# EAGLE design 00A-95 (EAGLE 6.3)
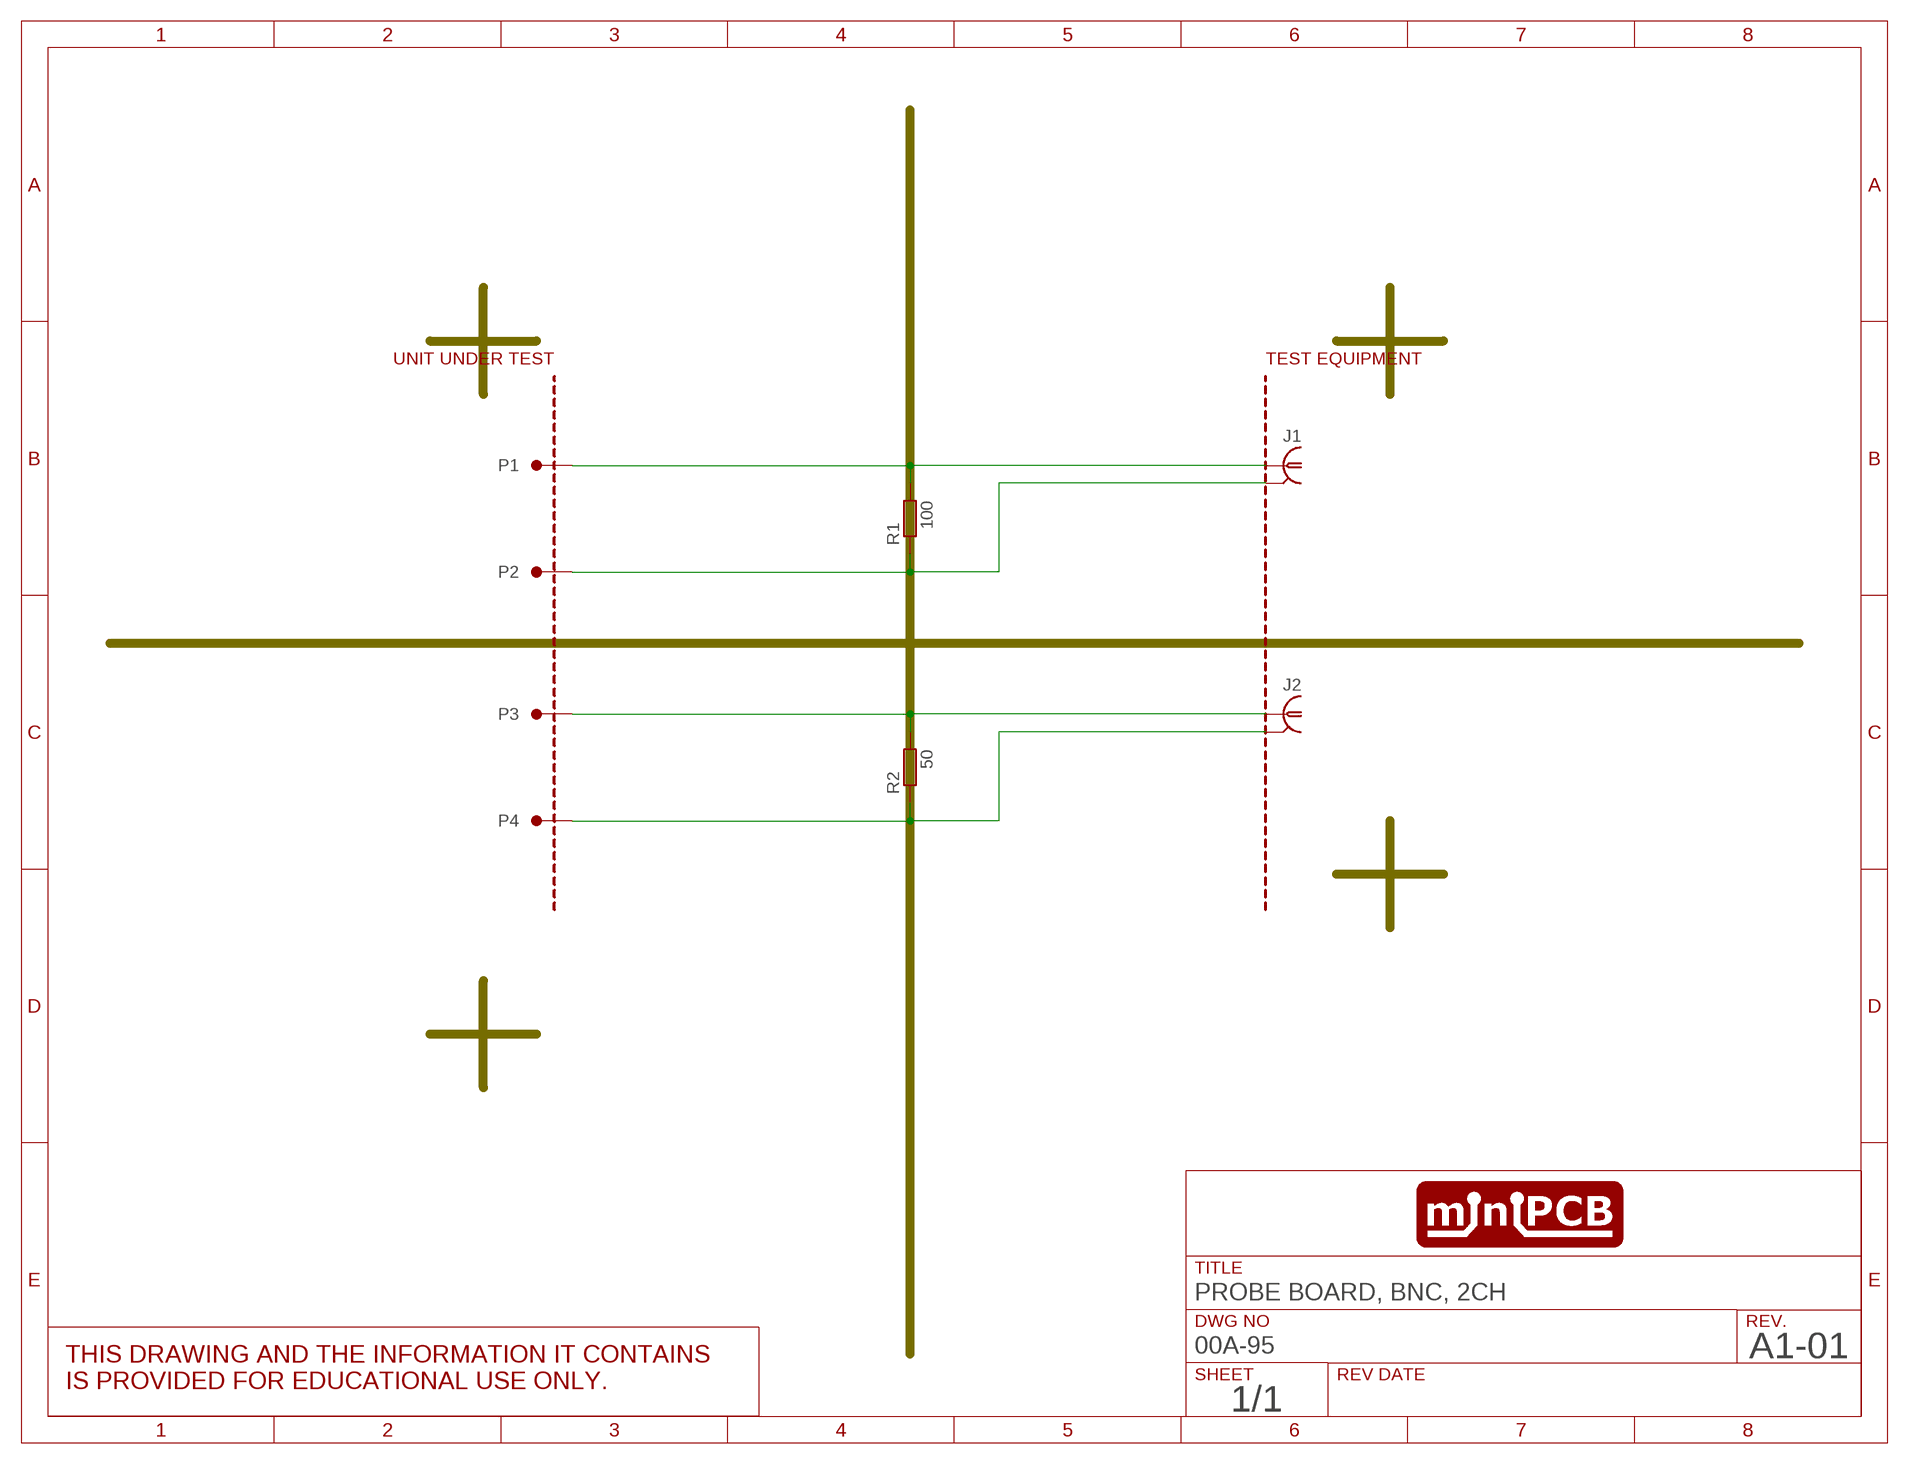
[diagram p0: schematic, sheet 1]
SHEET1 (SCHEMATIC): DWG_NO: 00A-95; REV: A1-01; TITLE: PROBE BOARD, BNC, 2CH

## Parts
J1  BNC_RA  [BNC_RIGHTANGLE]
J2  BNC_RA  [BNC_RIGHTANGLE]
P1  PINS_124AWG-NOTEXT  [PINS_1_1MM-NOTEXT]
P2  PINS_124AWG-NOTEXT  [PINS_1_1MM-NOTEXT]
P3  PINS_124AWG-NOTEXT  [PINS_1_1MM-NOTEXT]
P4  PINS_124AWG-NOTEXT  [PINS_1_1MM-NOTEXT]
PCB1  MINIPCB_0P50X50  [MINIPCB_0P_50X50MM]
R1  100  RESISTORSMD  [R0805]
R2  50  RESISTORSMD  [R0805]

## Nets
N$1: J2.1 P3.1 P3.2 R2.2
N$2: J2.2(GND) P4.1 P4.2 R2.1
N$3: J1.1 P1.1 P1.2 R1.2
N$4: J1.2(GND) P2.1 P2.2 R1.1

## Library data of the parts
J1 J2 = minipcb:BNC
P1-P4 = minipcb:PINS_1
PCB1 = minipcb:MINIPCB_0P; CIRCUIT_CATEGORY: miniPCB, TEST BOARDS; PART_NUMBER: 00A-95-A1-01; REVISION: A1; TITLE: PROBE BOARD, BNC, 2CH
R1 R2 = minipcb:RESISTOR

## Board
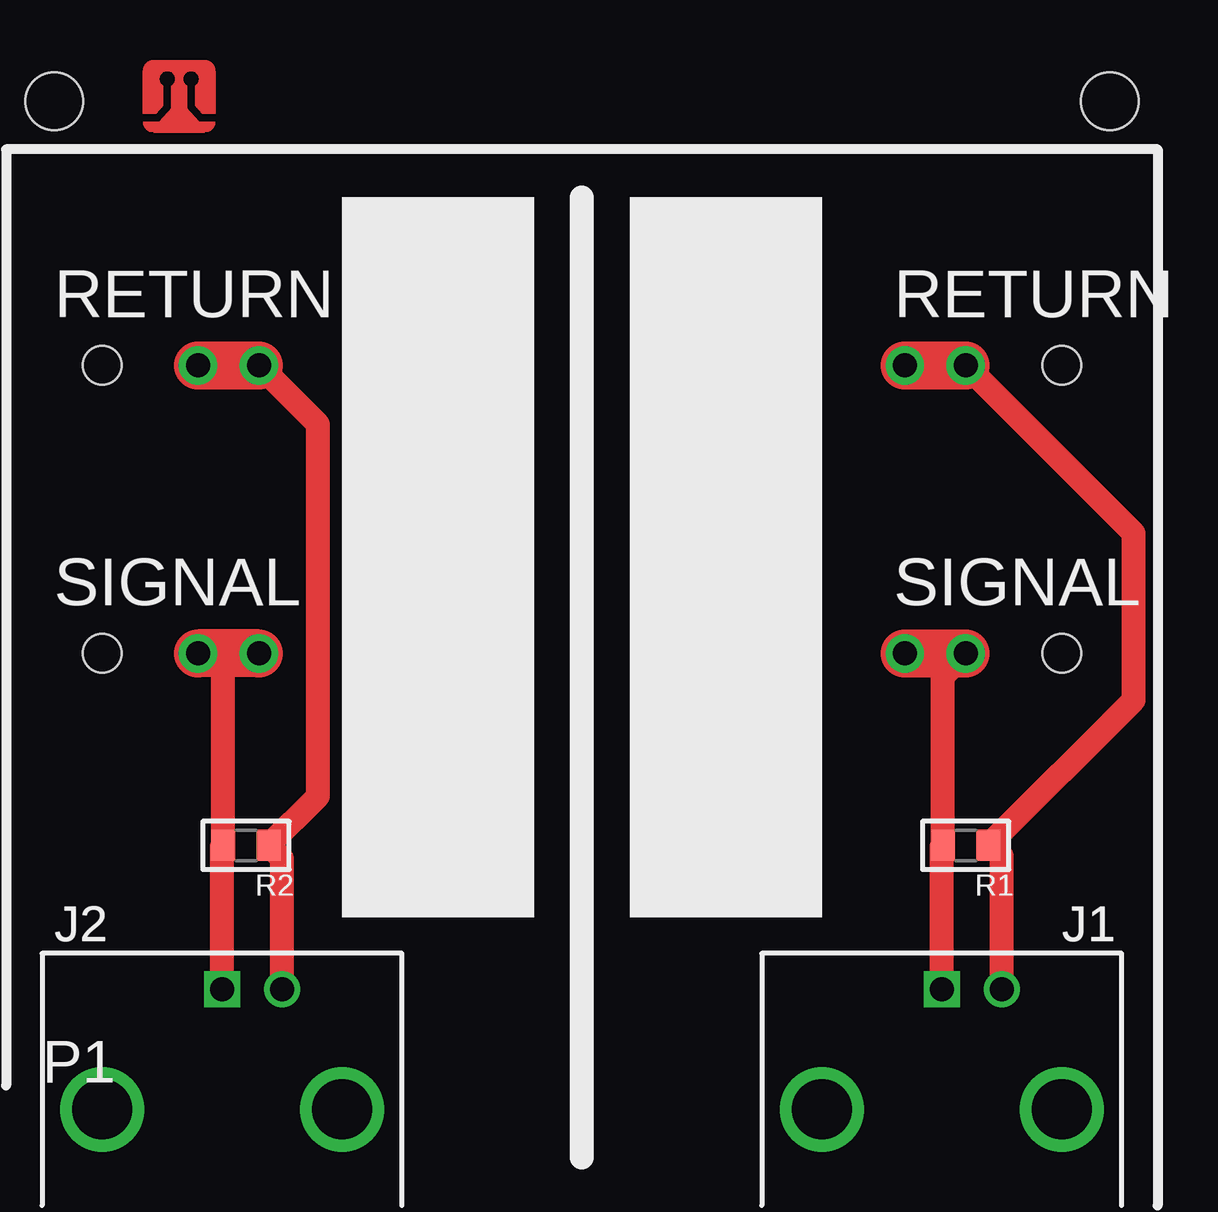
[diagram p1: board, top side]
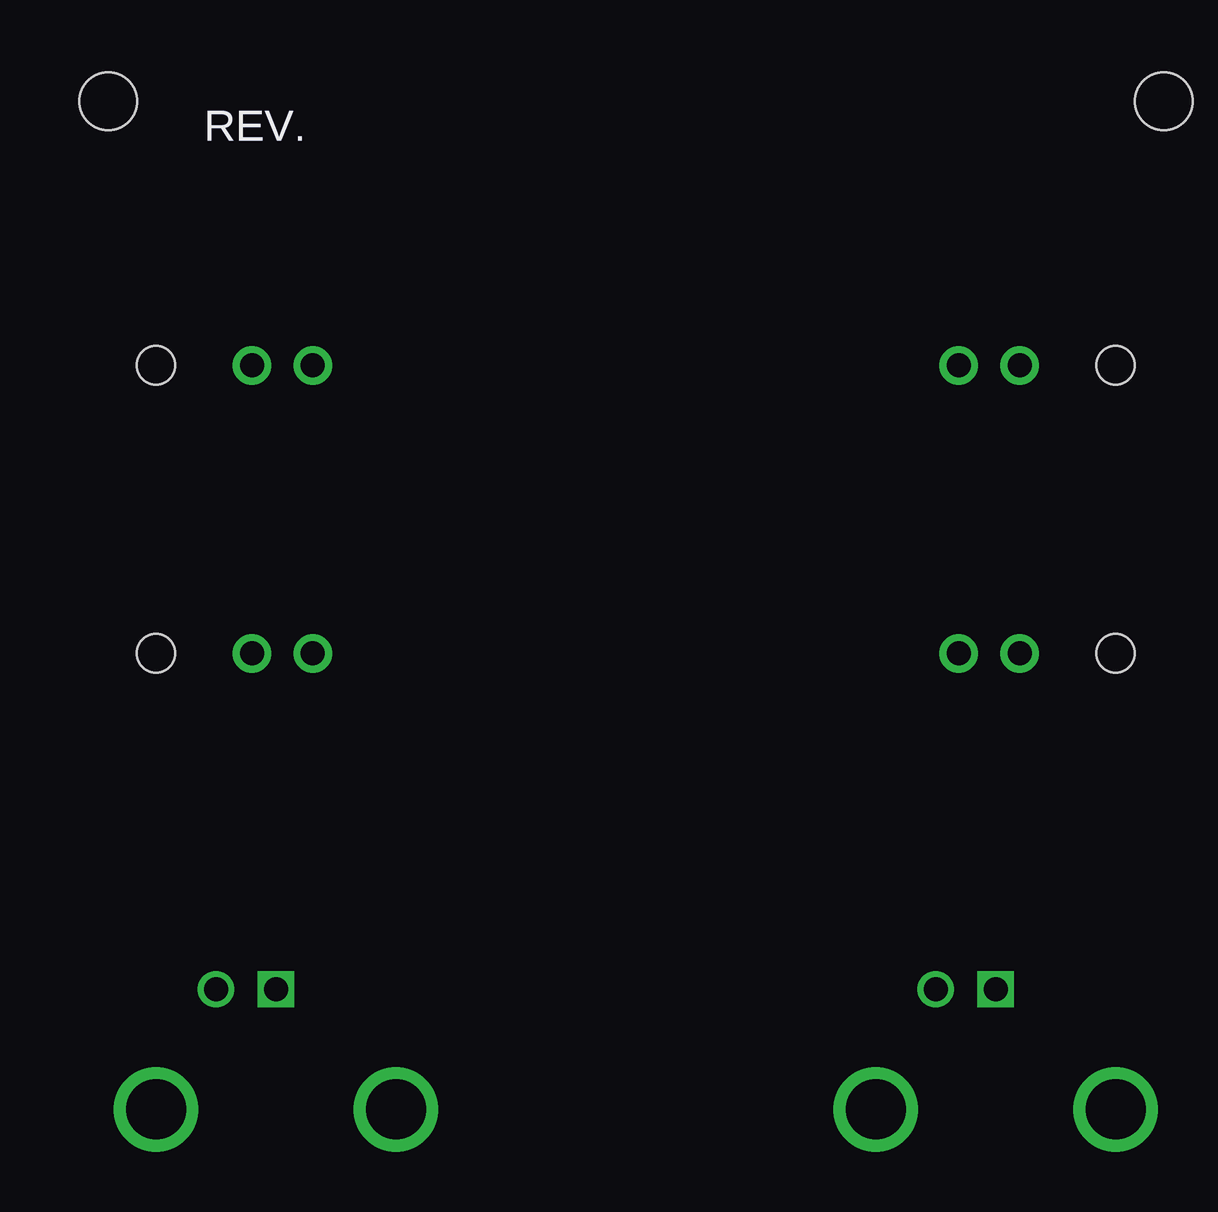
[diagram p2: board, bottom side, seen from below]

No outline drawn. Coordinates in mm, seen from the top.
Copper layers (1*16): Top 0.035mm / dielectric 1.5mm / Bottom 0.035mm
Design rules "default": minimum track width 10mil, minimum drill 0.6mm, track to track 8mil, track to pad 8mil, pad to pad 8mil, via to via 8mil, smd to smd 8mil, copper to edge 40mil, drill to drill 8mil, minimum pad ring 10mil, minimum via ring 8mil, stop-mask expansion 4mil, vias tented up to drill 0mil, thermal gap 10mil

### Footprints (pad centres in the part's own frame; a part is rotated, then mirrored left to right if it is on the bottom)
BNC_RIGHTANGLE = drill 1 square: 1 0,0 | drill 1: 2 -2.5,0 | drill 2.5: 3 -5,5; 4 5,5
PINS_1_1MM-NOTEXT = drill 1 pad 1.6: 1 4,0; 2 6.54,0 | hole 1.6: 0,0
MINIPCB_0P_50X50MM = hole 2.4: 47,47; 3,47
R0805 = smd 1 x 1.3: 1 -0.95,0; 2 0.95,0

### Placement (x,y rotation side)
J1  40,10 180 top
J2  10,10 180 top
P1  45,24 180 top
P2  45,36 180 top
P3  5,24 0 top
P4  5,36 0 top
PCB1  0,0 0 top
R1  41,16 180 top
R2  11,16 180 top

### Tracks (layer width: path | path; a pad name or v marks a point on that pad's centre or on a via)
N$1
  Top 1: J2.1 10,15.95 R2.2 10.05,23.95 10,24 P3.1
  Top 2: P3.2 P3.1
N$2
  Top 1: J2.2 12.5,15.45 R2.1 14,18.05 14,33.54 P4.2
  Top 2: P4.1 P4.2
N$3
  Top 1: J1.1 40,15.95 R1.2 40.05,23.05 P1.1
  Top 2: P1.2 P1.1
N$4
  Top 1: J1.2 42.5,15.55 42,16.05 R1.1 48,22.05 48,29 P2.1
  Top 2: P2.2 P2.1

### Text on the board
tPlace: RETURN | RETURN | SIGNAL | SIGNAL
_tNames: R2 | R1 | J2 | J1